# Altium schematic sheet схема.SchDoc
size A1
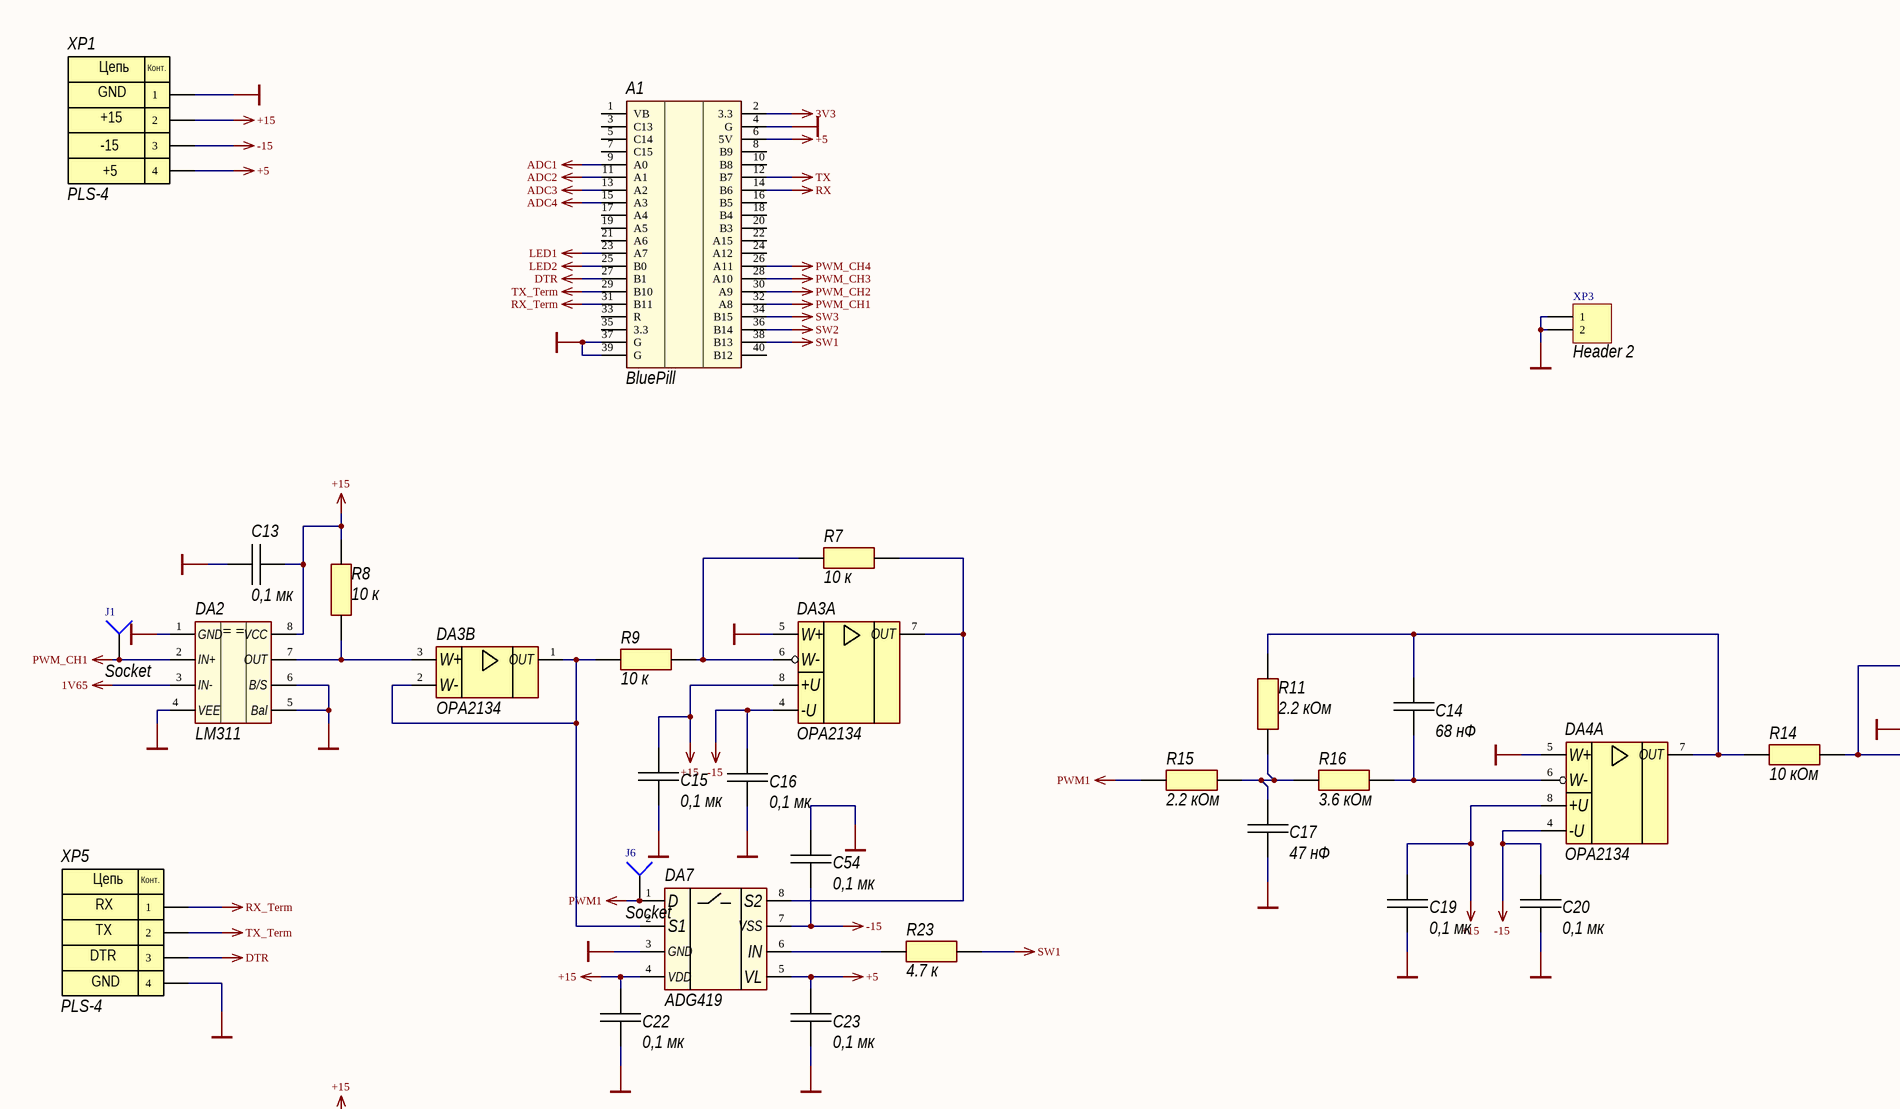
[diagram p0: схема.SchDoc, top left]
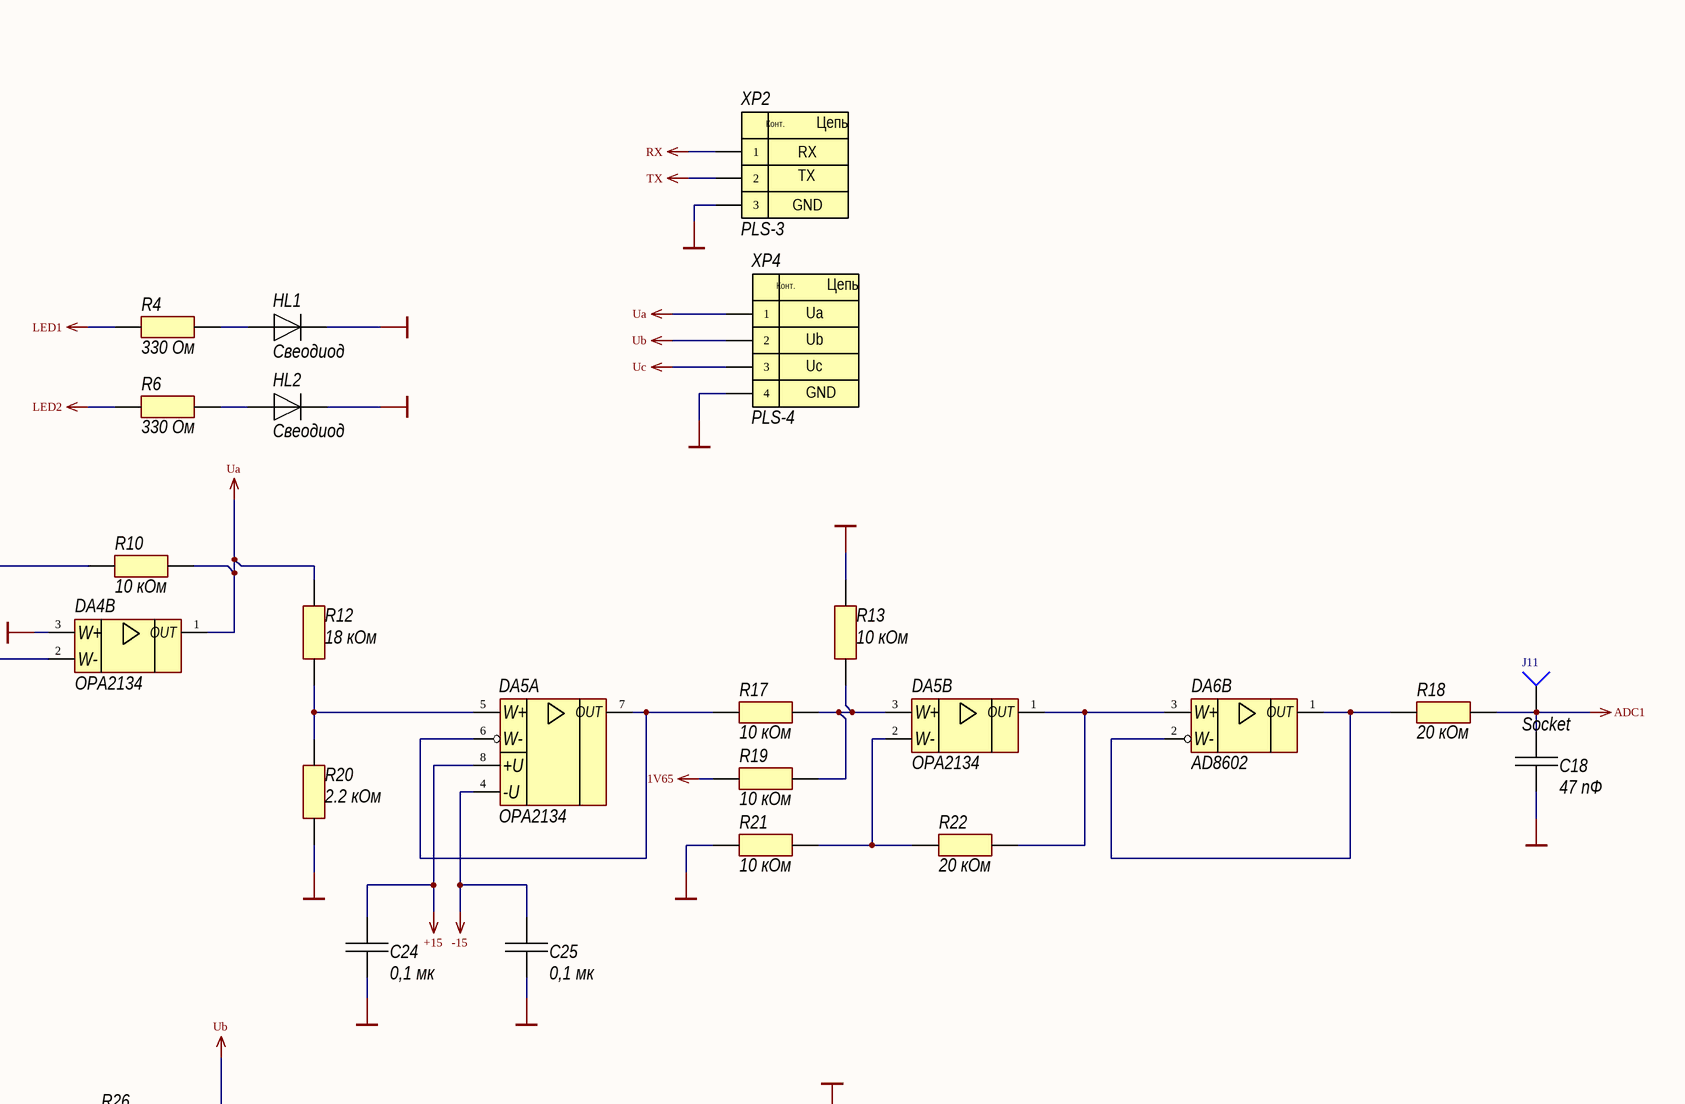
[diagram p1: схема.SchDoc, top right]
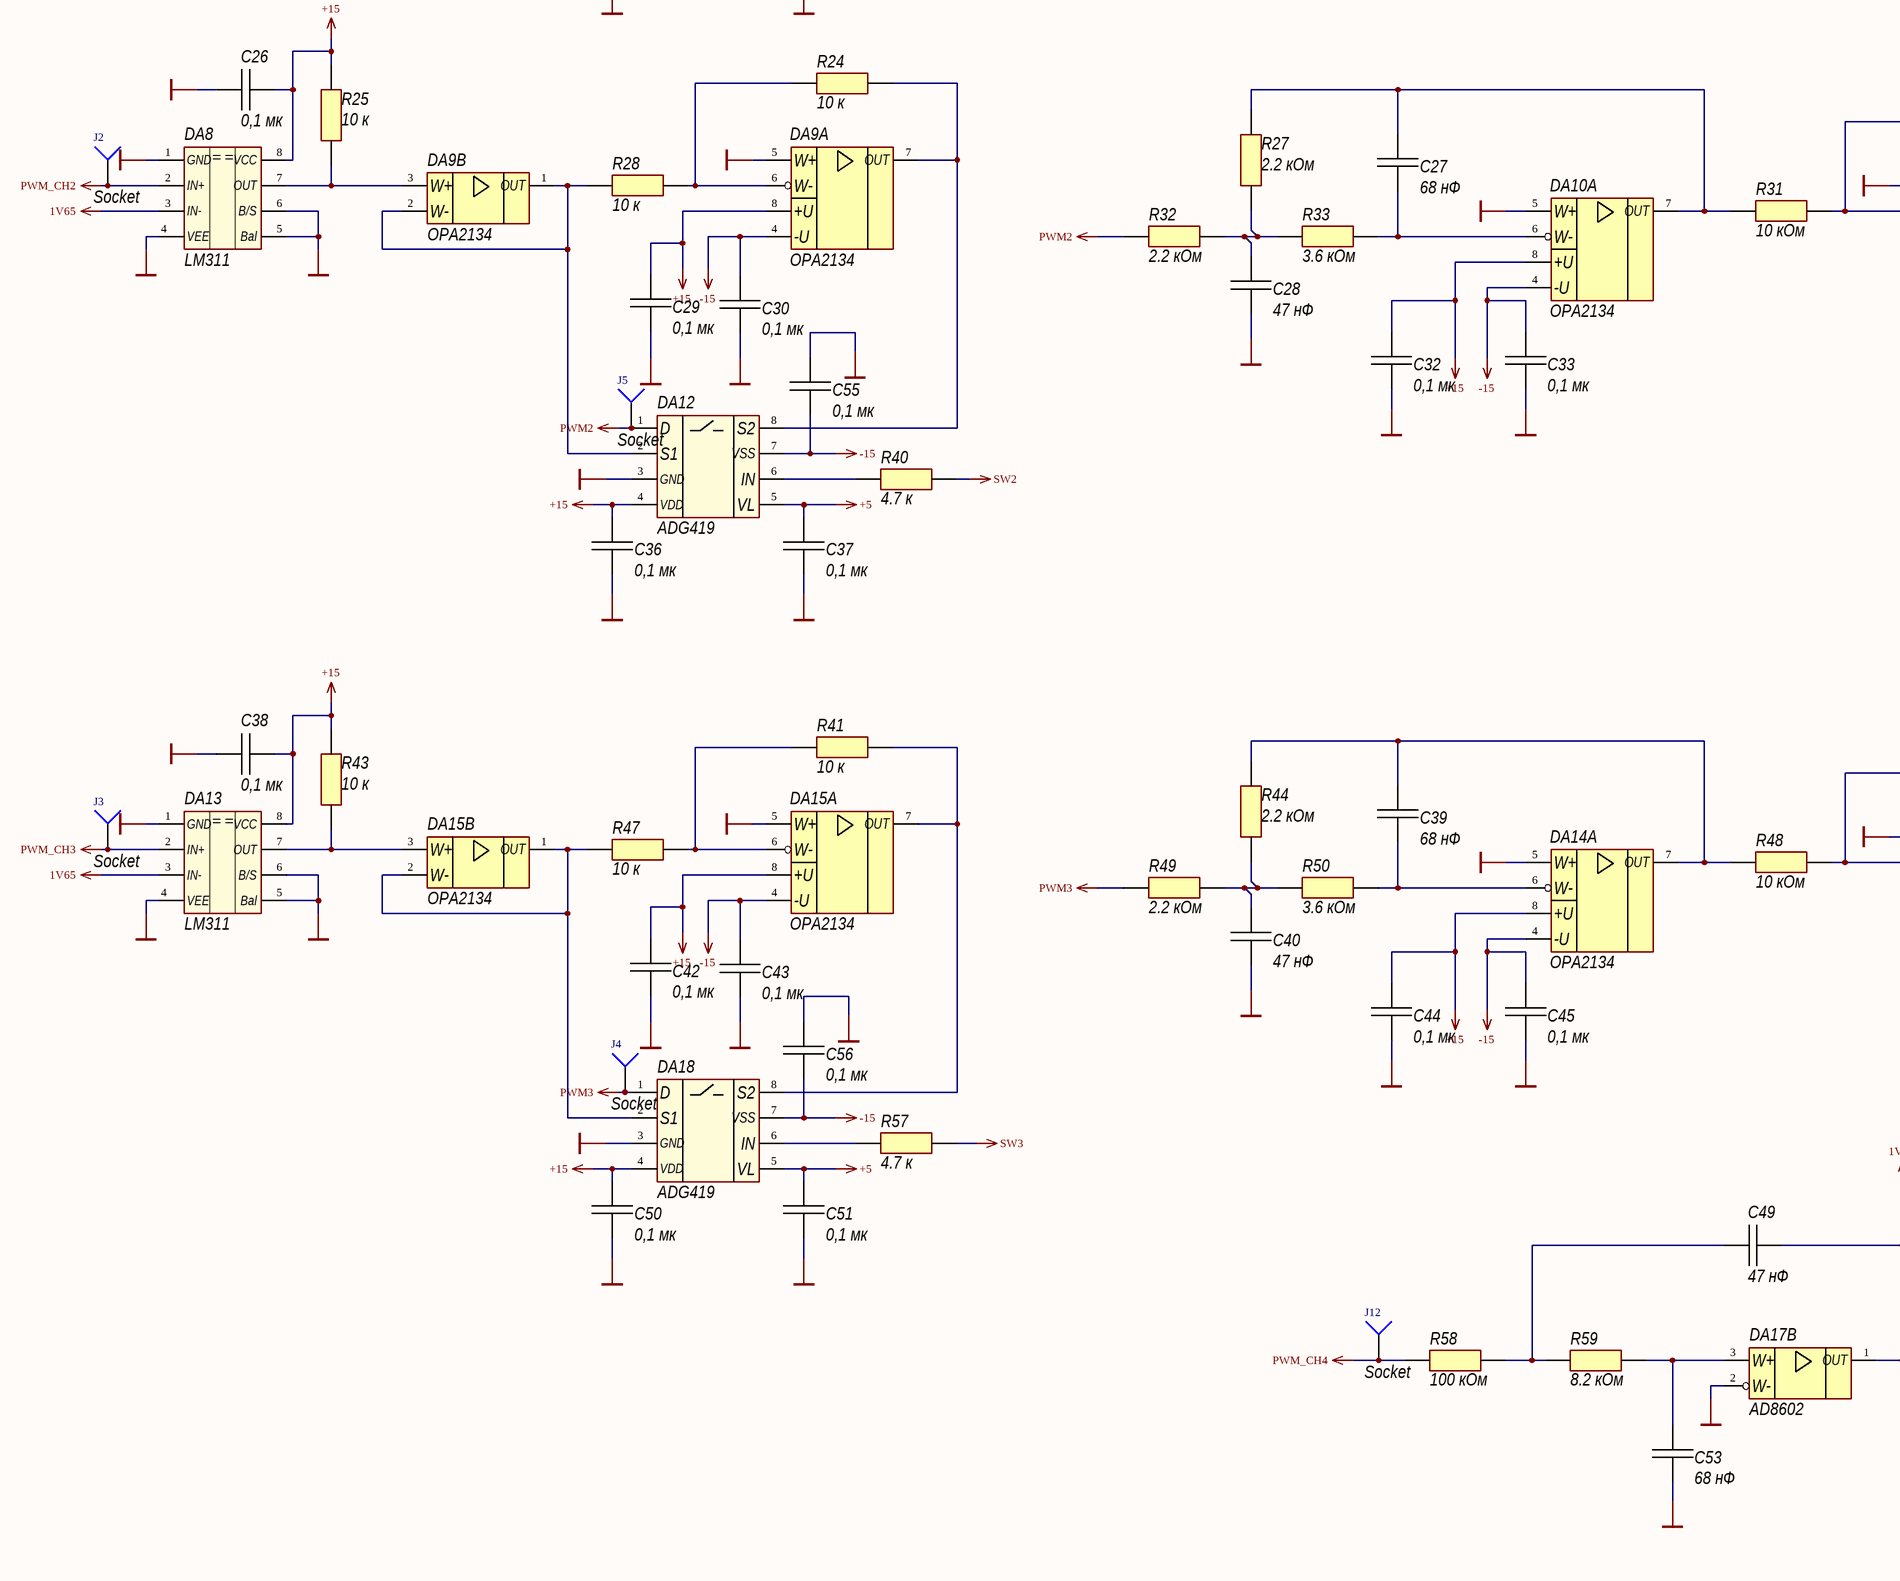
[diagram p2: схема.SchDoc, bottom left]
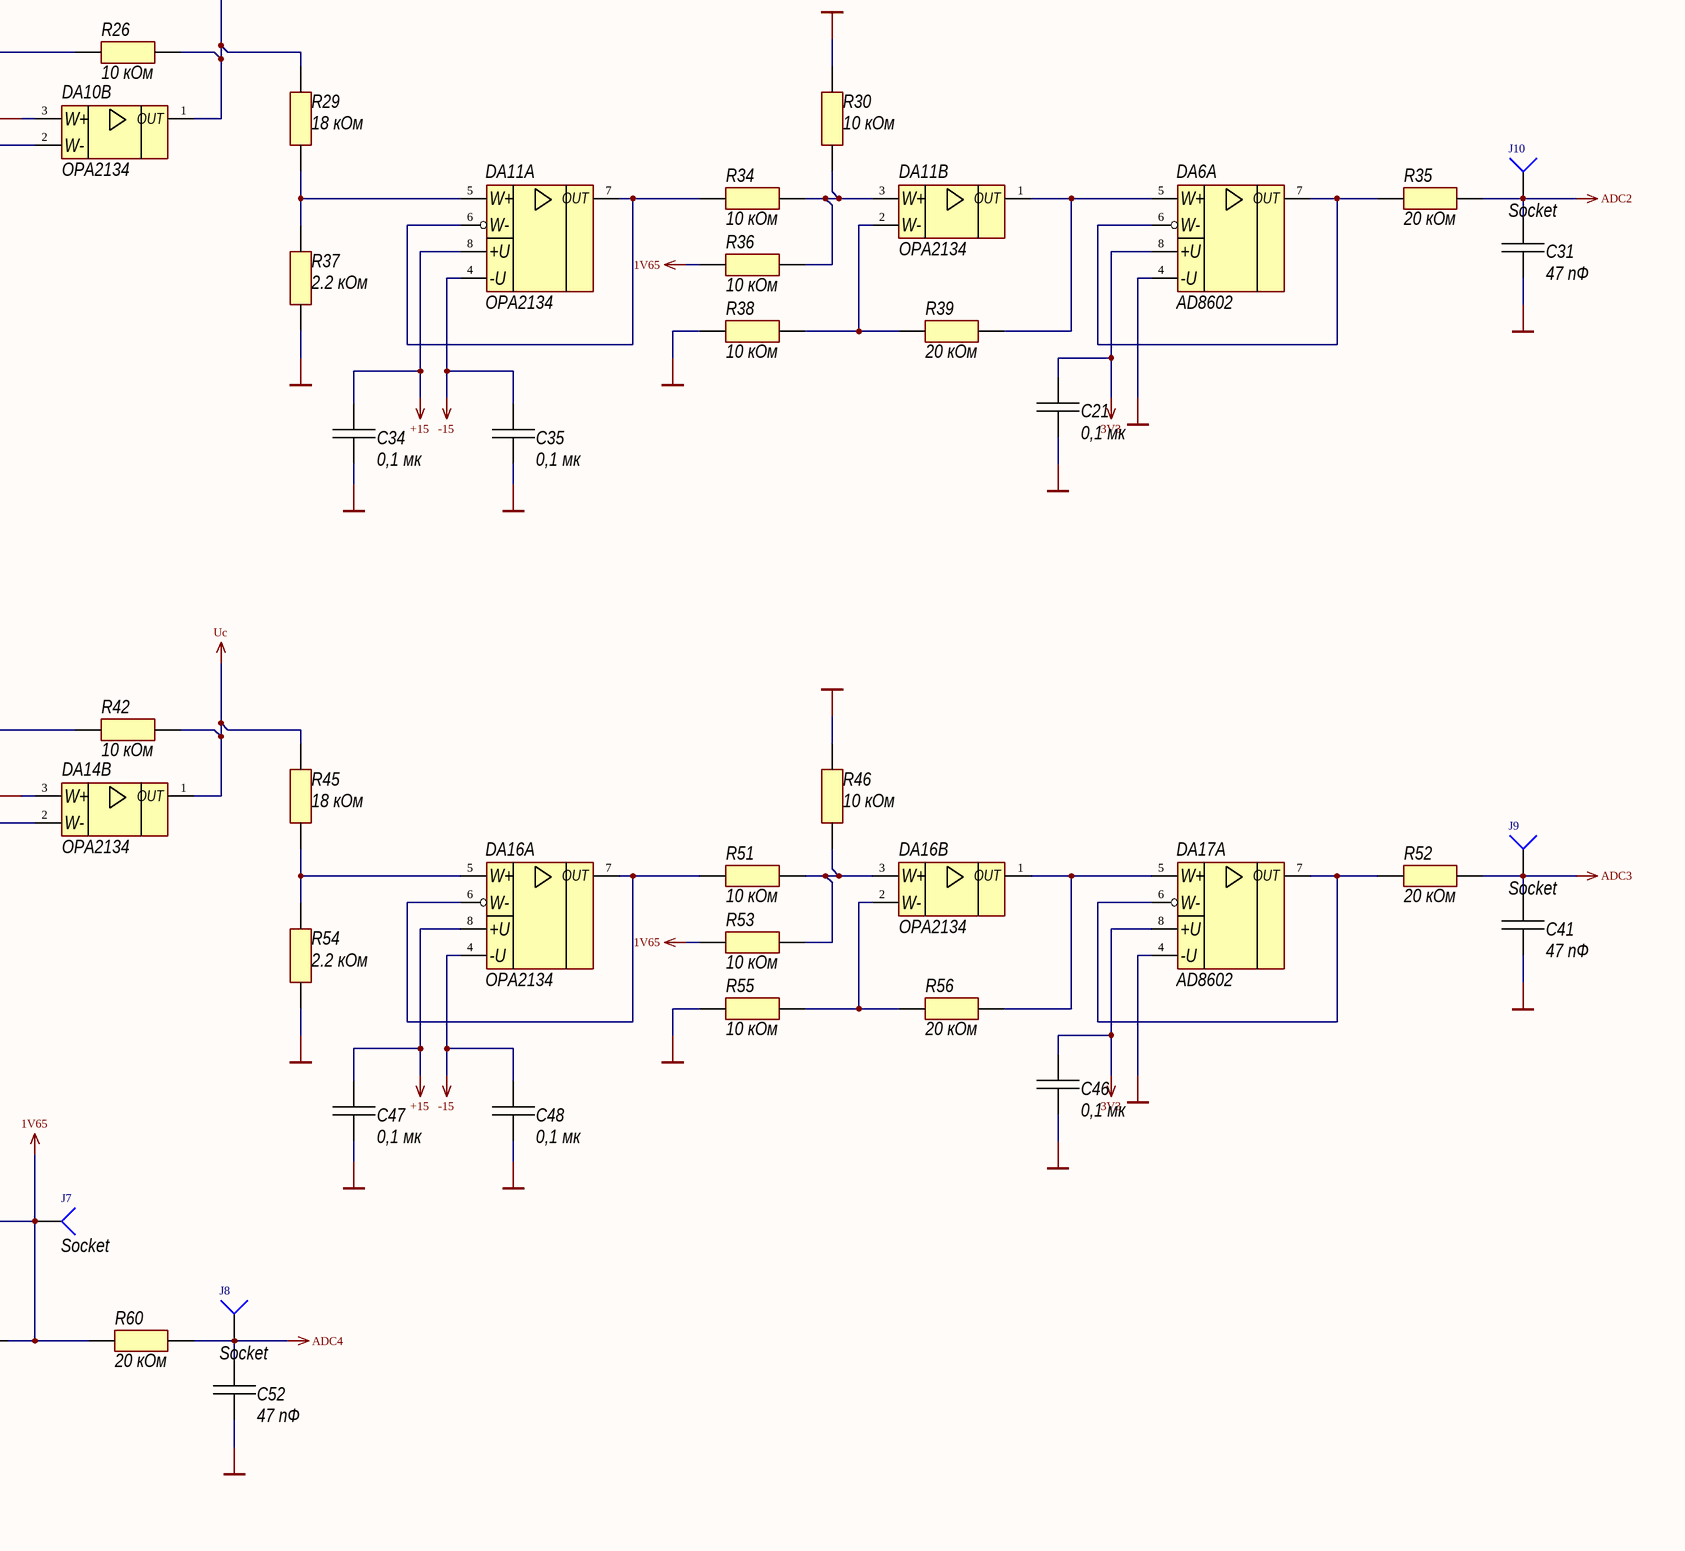
[diagram p3: схема.SchDoc, bottom right]

## Parts
A1  BluePill  [BluePill]
C13  0,1 мк  [CA_0805]
C14  68 нФ  [CA_0805]
C15  0,1 мк  [CA_0805]
C16  0,1 мк  [CA_0805]
C17  47 нФ  [CA_0805]
C18  47 пФ  [CA_0805]
C19  0,1 мк  [CA_0805]
C20  0,1 мк  [CA_0805]
C21  0,1 мк  [CA_0805]
C22  0,1 мк  [CA_0805]
C23  0,1 мк  [CA_0805]
C24  0,1 мк  [CA_0805]
C25  0,1 мк  [CA_0805]
C26  0,1 мк  [CA_0805]
C27  68 нФ  [CA_0805]
C28  47 нФ  [CA_0805]
C29  0,1 мк  [CA_0805]
C30  0,1 мк  [CA_0805]
C31  47 пФ  [CA_0805]
C32  0,1 мк  [CA_0805]
C33  0,1 мк  [CA_0805]
C34  0,1 мк  [CA_0805]
C35  0,1 мк  [CA_0805]
C36  0,1 мк  [CA_0805]
C37  0,1 мк  [CA_0805]
C38  0,1 мк  [CA_0805]
C39  68 нФ  [CA_0805]
C40  47 нФ  [CA_0805]
C41  47 пФ  [CA_0805]
C42  0,1 мк  [CA_0805]
C43  0,1 мк  [CA_0805]
C44  0,1 мк  [CA_0805]
C45  0,1 мк  [CA_0805]
C46  0,1 мк  [CA_0805]
C47  0,1 мк  [CA_0805]
C48  0,1 мк  [CA_0805]
C49  47 нФ  [CA_0805]
C50  0,1 мк  [CA_0805]
C51  0,1 мк  [CA_0805]
C52  47 пФ  [CA_0805]
C53  68 нФ  [CA_0805]
C54  0,1 мк  [CA_0805]
C55  0,1 мк  [CA_0805]
C56  0,1 мк  [CA_0805]
DA2  LM311  [SC_SOIC8]
DA3  OPA2134  [SC_SOIC8]  (parts A,B of 2)
DA4  OPA2134  [SC_SOIC8]  (parts A,B of 2)
DA5  OPA2134  [SC_SOIC8]  (parts A,B of 2)
DA6  AD8602  [SC_SOIC8]  (parts A,B of 2)
DA7  ADG419  [SC_SOIC8]
DA8  LM311  [SC_SOIC8]
DA9  OPA2134  [SC_SOIC8]  (parts A,B of 2)
DA10  OPA2134  [SC_SOIC8]  (parts A,B of 2)
DA11  OPA2134  [SC_SOIC8]  (parts A,B of 2)
DA12  ADG419  [SC_SOIC8]
DA13  LM311  [SC_SOIC8]
DA14  OPA2134  [SC_SOIC8]  (parts A,B of 2)
DA15  OPA2134  [SC_SOIC8]  (parts A,B of 2)
DA16  OPA2134  [SC_SOIC8]  (parts A,B of 2)
DA17  AD8602  [SC_SOIC8]  (parts A,B of 2)
DA18  ADG419  [SC_SOIC8]
HL1  Свеодиод  [DI_LED_0805]
HL2  Свеодиод  [DI_LED_0805]
J1  Socket  [PIN1]
J2  Socket  [PIN1]
J3  Socket  [PIN1]
J4  Socket  [PIN1]
J5  Socket  [PIN1]
J6  Socket  [PIN1]
J7  Socket  [PIN1]
J8  Socket  [PIN1]
J9  Socket  [PIN1]
J10  Socket  [PIN1]
J11  Socket  [PIN1]
J12  Socket  [PIN1]
R4  330 Ом  [RE_0805]
R6  330 Ом  [RE_0805]
R7  10 к  [RE_0805]
R8  10 к  [RE_0805]
R9  10 к  [RE_0805]
R10  10 кОм  [RE_0805]
R11  2.2 кОм  [RE_0805]
R12  18 кОм  [RE_0805]
R13  10 кОм  [RE_0805]
R14  10 кОм  [RE_0805]
R15  2.2 кОм  [RE_0805]
R16  3.6 кОм  [RE_0805]
R17  10 кОм  [RE_0805]
R18  20 кОм  [RE_0805]
R19  10 кОм  [RE_0805]
R20  2.2 кОм  [RE_0805]
R21  10 кОм  [RE_0805]
R22  20 кОм  [RE_0805]
R23  4.7 к  [RE_0805]
R24  10 к  [RE_0805]
R25  10 к  [RE_0805]
R26  10 кОм  [RE_0805]
R27  2.2 кОм  [RE_0805]
R28  10 к  [RE_0805]
R29  18 кОм  [RE_0805]
R30  10 кОм  [RE_0805]
R31  10 кОм  [RE_0805]
R32  2.2 кОм  [RE_0805]
R33  3.6 кОм  [RE_0805]
R34  10 кОм  [RE_0805]
R35  20 кОм  [RE_0805]
R36  10 кОм  [RE_0805]
R37  2.2 кОм  [RE_0805]
R38  10 кОм  [RE_0805]
R39  20 кОм  [RE_0805]
R40  4.7 к  [RE_0805]
R41  10 к  [RE_0805]
R42  10 кОм  [RE_0805]
R43  10 к  [RE_0805]
R44  2.2 кОм  [RE_0805]
R45  18 кОм  [RE_0805]
R46  10 кОм  [RE_0805]
R47  10 к  [RE_0805]
R48  10 кОм  [RE_0805]
R49  2.2 кОм  [RE_0805]
R50  3.6 кОм  [RE_0805]
R51  10 кОм  [RE_0805]
R52  20 кОм  [RE_0805]
R53  10 кОм  [RE_0805]
R54  2.2 кОм  [RE_0805]
R55  10 кОм  [RE_0805]
R56  20 кОм  [RE_0805]
R57  4.7 к  [RE_0805]
R58  100 кОм  [RE_0805]
R59  8.2 кОм  [RE_0805]
R60  20 кОм  [RE_0805]
XP1  PLS-4  [PLS4]
XP2  PLS-3  [PLS3]
XP3  Header 2  [HDR1X2]
XP4  PLS-4  [PLS4]
XP5  PLS-4  [PLS4]

## Nets
1V65: C49.2 DA2.3(IN-) DA8.3(IN-) DA13.3(IN-) DA17.1(OUT) J7.1 R19.2 R36.2 R53.2 R60.2
3V3: A1.2(3.3) C21.2 C46.2 DA6.8(+U) DA17.8(+U)
+5: A1.6(5V) C23.2 C37.2 C51.2 DA7.5(VL) DA12.5(VL) DA18.5(VL) XP1.4
+15: C13.1 C15.2 C19.2 C22.2 C24.2 C26.1 C29.2 C32.2 C34.2 C36.2 C38.1 C42.2 C44.2 C47.2 C50.2 DA2.8(VCC) DA3.8(+U) DA4.8(+U) DA5.8(+U) DA7.4(VDD) DA8.8(VCC) DA9.8(+U) DA10.8(+U) DA11.8(+U) DA12.4(VDD) DA13.8(VCC) DA14.8(+U) DA15.8(+U) DA16.8(+U) DA18.4(VDD) R8.1 R25.1 R43.1 XP1.2
-15: C16.2 C20.2 C25.2 C30.2 C33.2 C35.2 C43.2 C45.2 C48.2 C54.1 C55.1 C56.1 DA3.4(-U) DA4.4(-U) DA5.4(-U) DA7.7(VSS) DA9.4(-U) DA10.4(-U) DA11.4(-U) DA12.7(VSS) DA14.4(-U) DA15.4(-U) DA16.4(-U) DA18.7(VSS) XP1.3
ADC1: A1.9(A0) C18.2 J11.1 R18.1
ADC2: A1.11(A1) C31.2 J10.1 R35.1
ADC3: A1.13(A2) C41.2 J9.1 R52.1
ADC4: A1.15(A3) C52.2 J8.1 R60.1
DTR: A1.27(B1) XP5.3
GND: A1.4(G) A1.37(G) A1.39(G) C13.2 C15.1 C16.1 C17.1 C18.1 C19.1 C20.1 C21.1 C22.1 C23.1 C24.1 C25.1 C26.2 C28.1 C29.1 C30.1 C31.1 C32.1 C33.1 C34.1 C35.1 C36.1 C37.1 C38.2 C40.1 C41.1 C42.1 C43.1 C44.1 C45.1 C46.1 C47.1 C48.1 C50.1 C51.1 C52.1 C53.2 C54.2 C55.2 C56.2 DA2.1(GND) DA2.4(VEE) DA2.5(Bal) DA2.6(B/S) DA3.5(W+) DA4.3(W+) DA4.5(W+) DA6.4(-U) DA7.3(GND) DA8.1(GND) DA8.4(VEE) DA8.5(Bal) DA8.6(B/S) DA9.5(W+) DA10.3(W+) DA10.5(W+) DA12.3(GND) DA13.1(GND) DA13.4(VEE) DA13.5(Bal) DA13.6(B/S) DA14.3(W+) DA14.5(W+) DA15.5(W+) DA17.2(W-) DA17.4(-U) DA18.3(GND) HL1.2 HL2.2 R13.1 R20.1 R21.2 R30.1 R37.1 R38.2 R46.1 R54.1 R55.2 XP1.1 XP2.3 XP3.1 XP3.2 XP4.4 XP5.4
LED1: A1.23(A7) R4.1
LED2: A1.25(B0) R6.1
PWM1: DA7.1(D) J6.1 R15.1
PWM2: DA12.1(D) J5.1 R32.1
PWM3: DA18.1(D) J4.1 R49.1
PWM_CH1: A1.32(A8) DA2.2(IN+) J1.1
PWM_CH2: A1.30(A9) DA8.2(IN+) J2.1
PWM_CH3: A1.28(A10) DA13.2(IN+) J3.1
PWM_CH4: A1.26(A11) J12.1 R58.1
RX: A1.14(B6) XP2.1
RX_Term: A1.31(B11) XP5.1
SW1: A1.38(B13) R23.2
SW2: A1.36(B14) R40.2
SW3: A1.34(B15) R57.2
TX: A1.12(B7) XP2.2
TX_Term: A1.29(B10) XP5.2
Ua: DA4.1(OUT) R10.2 R12.2 XP4.1
Ub: DA10.1(OUT) R26.2 R29.2 XP4.2
Uc: DA14.1(OUT) R42.2 R45.2 XP4.3
NetC14_1: C14.1 DA4.6(W-) R16.2
NetC14_2: C14.2 DA4.7(OUT) R11.2 R14.1
NetC17_2: C17.2 R11.1 R15.2 R16.1
NetC27_1: C27.1 DA10.6(W-) R33.2
NetC27_2: C27.2 DA10.7(OUT) R27.2 R31.1
NetC28_2: C28.2 R27.1 R32.2 R33.1
NetC39_1: C39.1 DA14.6(W-) R50.2
NetC39_2: C39.2 DA14.7(OUT) R44.2 R48.1
NetC40_2: C40.2 R44.1 R49.2 R50.1
NetC49_1: C49.1 R58.2 R59.1
NetC53_1: C53.1 DA17.3(W+) R59.2
NetDA2_7: DA2.7(OUT) DA3.3(W+) R8.2
NetDA3_1: DA3.1(OUT) DA3.2(W-) DA7.2(S1) R9.1
NetDA3_6: DA3.6(W-) R7.1 R9.2
NetDA3_7: DA3.7(OUT) DA7.8(S2) R7.2
NetDA4_2: DA4.2(W-) R10.1 R14.2
NetDA5_1: DA5.1(OUT) DA6.3(W+) R22.1
NetDA5_2: DA5.2(W-) R21.1 R22.2
NetDA5_3: DA5.3(W+) R13.2 R17.1 R19.1
NetDA5_5: DA5.5(W+) R12.1 R20.2
NetDA5_6: DA5.6(W-) DA5.7(OUT) R17.2
NetDA6_1: DA6.1(OUT) DA6.2(W-) R18.2
NetDA6_5: DA6.5(W+) DA11.1(OUT) R39.1
NetDA6_6: DA6.6(W-) DA6.7(OUT) R35.2
NetDA7_6: DA7.6(IN) R23.1
NetDA8_7: DA8.7(OUT) DA9.3(W+) R25.2
NetDA9_1: DA9.1(OUT) DA9.2(W-) DA12.2(S1) R28.1
NetDA9_6: DA9.6(W-) R24.1 R28.2
NetDA9_7: DA9.7(OUT) DA12.8(S2) R24.2
NetDA10_2: DA10.2(W-) R26.1 R31.2
NetDA11_2: DA11.2(W-) R38.1 R39.2
NetDA11_3: DA11.3(W+) R30.2 R34.1 R36.1
NetDA11_5: DA11.5(W+) R29.1 R37.2
NetDA11_6: DA11.6(W-) DA11.7(OUT) R34.2
NetDA12_6: DA12.6(IN) R40.1
NetDA13_7: DA13.7(OUT) DA15.3(W+) R43.2
NetDA14_2: DA14.2(W-) R42.1 R48.2
NetDA15_1: DA15.1(OUT) DA15.2(W-) DA18.2(S1) R47.1
NetDA15_6: DA15.6(W-) R41.1 R47.2
NetDA15_7: DA15.7(OUT) DA18.8(S2) R41.2
NetDA16_1: DA16.1(OUT) DA17.5(W+) R56.1
NetDA16_2: DA16.2(W-) R55.1 R56.2
NetDA16_3: DA16.3(W+) R46.2 R51.1 R53.1
NetDA16_5: DA16.5(W+) R45.1 R54.2
NetDA16_6: DA16.6(W-) DA16.7(OUT) R51.2
NetDA17_6: DA17.6(W-) DA17.7(OUT) R52.2
NetDA18_6: DA18.6(IN) R57.1
NetHL1_1: HL1.1 R4.2
NetHL2_1: HL2.1 R6.2

Not connected (* = marked no-connect by the designer): A1 1(VB) 3(C13) 5(C14) 7(C15) 8(B9) 10(B8) 16(B5) 17(A4) 18(B4) 19(A5) 20(B3) 21(A6) 22(A15) 24(A12) 33(R) 35(3.3) 40(B12)

## Notes on the sheet
- (near XP1) GND
- (near XP1) +15
- (near XP1) -15
- (near XP1) +5
- RX
- TX
- (near XP2) GND
- (near XP4) Ua
- (near XP4) GND
- (near XP4) Uc
- (near XP4) Ub
- (near XP5) DTR
- (near XP5) GND
- (in symbol PLS-3) Конт.; Цепь
- (in symbol PLS-4) Цепь; Конт.

## Library data of the parts
C13-C56 = Конденсатор
R4 R6-R60 = Резистор
XP3 = Header 2: Header, 2-Pin; LatestRevisionDate: 17-Jul-2002; LatestRevisionNote: Re-released for DXP Platform.; Publisher: Altium Limited
J1-J12 = Socket: LatestRevisionDate: 17-Jul-2002; LatestRevisionNote: Re-released for DXP Platform.; Publisher: Altium Limited